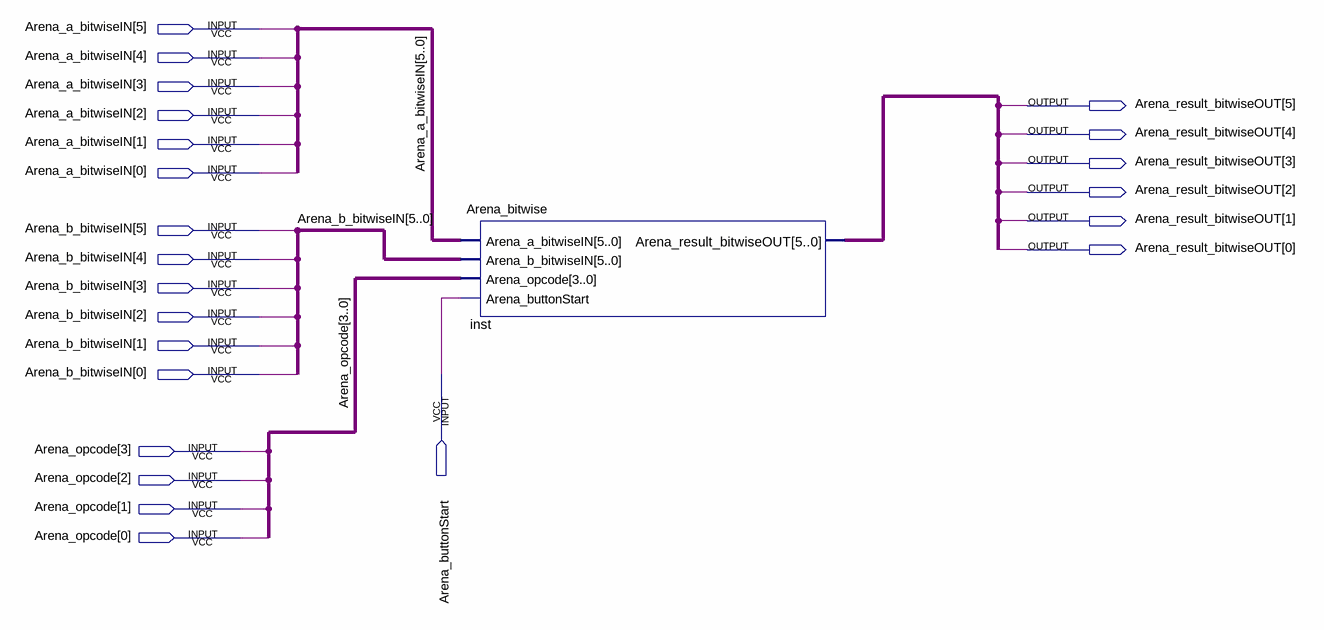
[diagram p0: schematic sheet]
// Quartus schematic Arena_bitwise_2.bdf as structural Verilog: 1 symbols, 23 pins
module Arena_bitwise_2 (
  input  [5:0] Arena_a_bitwiseIN,
  input  [5:0] Arena_b_bitwiseIN,
  input  Arena_buttonStart,
  input  [3:0] Arena_opcode,
  output [5:0] Arena_result_bitwiseOUT
);

  wire [5:0] inst_arena_result_bitwiseout;

  Arena_bitwise inst (
    .Arena_a_bitwiseIN(Arena_a_bitwiseIN), .Arena_b_bitwiseIN(Arena_b_bitwiseIN),
    .Arena_opcode(Arena_opcode), .Arena_buttonStart(Arena_buttonStart),
    .Arena_result_bitwiseOUT(inst_arena_result_bitwiseout));
endmodule
